# Altium schematic sheet input.SchDoc
size A; SheetNumber: 1; SheetTotal: 3
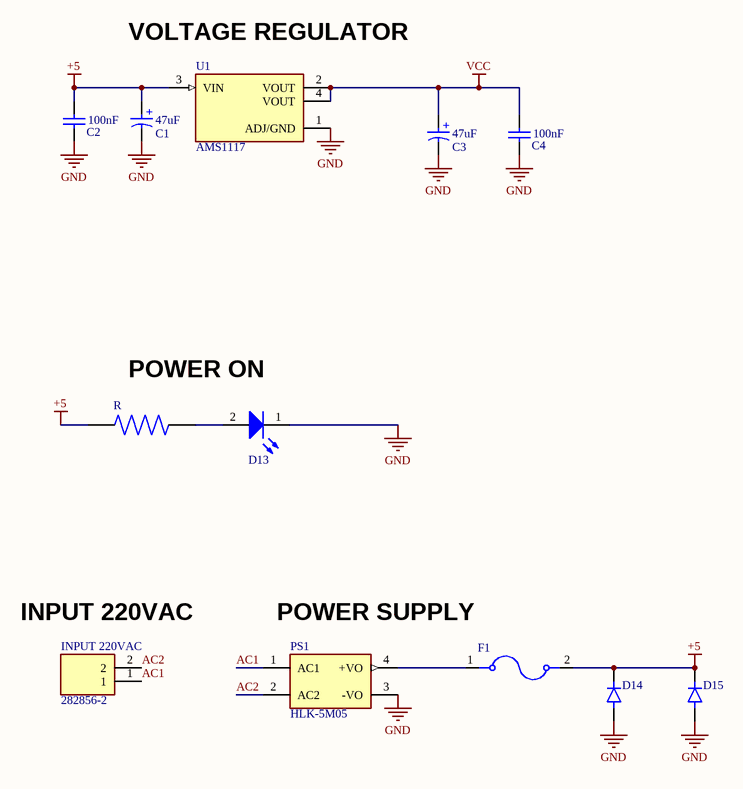
[diagram p0: input.SchDoc]

## Parts
C1  47uF  [WCAP-ASLI_D6.3H7.7]
C2  100nF  [WCAP-CSGP_0603_L1.6W0.8H0.8_Wave]
C3  47uF  [WCAP-ASLI_D6.3H7.7]
C4  100nF  [WCAP-CSGP_0603_L1.6W0.8H0.8_Wave]
D13  Infrared, 1.4V, 140°  [WL-SICW_0805_L2W1.3H0.8]  (value not drawn)
D14  S1G  [DIO_S1G]  (value not drawn)
D15  S1G  [DIO_S1G]  (value not drawn)
F1  0154004.DR  [FUSE_0154004.DR]  (value not drawn)
INPUT_220VAC  282856-2  [TE_282856-2]
PS1  HLK-5M05  [CONV_HLK-5M05]
R  FCR1206J10R  [RESC3216X70N]  (value not drawn)
U1  AMS1117  [SOT229P700X180-4N]

## Nets
+5: C1.1(P) C2.2 D14.1(K) D15.1(K) F1.2 R.1 U1.3(VIN)
GND: C1.2(N) C2.1 C3.2(N) C4.1 D13.1(K) D14.2(A) D15.2(A) PS1.3(-VO) U1.1(ADJ/GND)
VCC: C3.1(P) C4.2 U1.2(VOUT) U1.4(VOUT)
AC1: INPUT_220VAC.1 PS1.1(AC1)
AC2: INPUT_220VAC.2 PS1.2(AC2)
NetD13_2: D13.2(A) R.2
NetF1_1: F1.1 PS1.4(+VO)

## Notes on the sheet
- (near U1) VOLTAGE REGULATOR
- POWER ON
- (near INPUT_220VAC) INPUT 220VAC
- (near PS1) POWER SUPPLY
- (in symbol 865080443007) +

## Library data of the parts
C1 C3 = 865080443007: WCAP-ASLI Aluminum Electrolytic Capacitor, V-Chip, D6.3 x H5.5mm, 47uF, 25V; Manufacturer: Wurth Elektronik; Capacitance Tolerance: +/-20%; Dissipation Factor: 14%; Endurance: 2000h; Leakage Current: 11.75uA; Ripple Current: 220mA; Technical Reference: ASED055470M025DVCTBB000; Manufacturer Part Number: 865080443007; Category: Aluminum Electrolytic Capacitors; Match Code: WCAP-ASLI; ComponentLink1Description: Website Link; ComponentLink1URL: https://www.we-online.com/redexpert/article/865080443007?ad; ComponentLink2Description: Datasheet Link; ComponentLink2URL: https://www.we-online.com/redexpert/spec/865080443007?ad; Mount: Surface Mount; Operating Temperature Max: 105°C; Operating Temperature Min: -55°C; Packaging: Tape and Reel; Height: 5.5mm; Diameter: 6.3mm; Capacitance: 47uF; Rated Voltage (DC): 25V
C2 C4 = 885012206071: WCAP-CSGP Multilayer Ceramic Chip Capacitor, General Purpose, size 0603, X7R, 100nF, 25VDC; Manufacturer: Wurth Elektronik; Case/Size Code: 0603; Capacitance Tolerance: +/-10%; Dissipation Factor: 3.5%; Insulation Resistance: 5GΩ; Rated Voltage (DC): 25V; Technical Reference: X7R0603104K025DFCT10000; Manufacturer Part Number: 885012206071; Category: Multilayer Ceramic Chip Capacitors; Match Code: WCAP-CSGP; ComponentLink1Description: Website Link; ComponentLink1URL: https://www.we-online.com/redexpert/article/885012206071?ad; ComponentLink2Description: Datasheet Link; ComponentLink2URL: https://www.we-online.com/redexpert/spec/885012206071?ad; Mount: Surface Mount; Operating Temperature Max: 125°C; Operating Temperature Min: -55°C; Packaging: Tape and Reel; Length: 1.6mm; Width: 0.8mm; Height: 0.8mm; Capacitance: 100nF; Ceramic Type: X7R
D13 = 15412085BA400: WL-SICW SMT Chip LED Infrared Waterclear, size 1206, Infrared, 1.4V, 140°; Manufacturer: Wurth Elektronik; Case/Size Code: 1206; Centroid Wavelength: 850nm; Chip Technology: AlGaAs; Forward Voltage Max: 2V; Radiant Intensity: 2.5mW/sr; Radiant Intensity Min: 1mW/sr; Manufacturer Part Number: 15412085BA400; Category: Infrared LEDs; Match Code: WL-SICW; ComponentLink1Description: Website Link; ComponentLink1URL: https://www.we-online.com/redexpert/article/15412085BA400?ad; ComponentLink2Description: Datasheet Link; ComponentLink2URL: https://www.we-online.com/redexpert/spec/15412085BA400?ad; Mount: Surface Mount; Operating Temperature Max: 85°C; Operating Temperature Min: -40°C; Packaging: Tape and Reel; Length: 3.2mm; Width: 1.6mm; Height: 1.1mm; Emitting Color: Infrared; Forward Voltage: 1.4V; Peak Wavelength: 850nm; Viewing Angle: 140°
D14 D15 = S1G: Diode Standard 400 V 1A Surface Mount DO-214AC (SMA); MF: ON Semiconductor; SnapEDA_Link: https://www.snapeda.com/parts/S1G/Onsemi/view-part/?ref=snap; Value: *; MP: S1G; Availability: In Stock; Purchase-URL: https://pricing.snapeda.com/search/part/S1G/?ref=eda; Check_prices: https://www.snapeda.com/parts/S1G/Onsemi/view-part/?ref=eda; Package: SMA Taiwan Semiconductor; Price: None
F1 = 0154004.DR: 154/154T/154L/154TL Series OMNI-BLOKÂ® Fuse and Holder Assembly; Package: None; Availability: Unavailable; Value: *; MP: 0154004.DR; Price: None
INPUT_220VAC = 282856-2: TERMI-BLOK PCB MOUNT 2P; MF: TE Connectivity; Purchase-URL: https://pricing.snapeda.com/search/part/282856-2/?ref=eda; Package: None; MP: 282856-2; EU_RoHS_Compliance: Compliant with Exemptions; Price: None; Availability: In Stock; Value: *; Check_prices: https://www.snapeda.com/parts/282856-2/TE+Connectivity+AMP+Connectors/view-part/?ref=eda; SnapEDA_Link: https://www.snapeda.com/parts/282856-2/TE+Connectivity+AMP+Connectors/view-part/?ref=snap
PS1 = HLK-5M05: AC DC 220V to 5V 5W 5Watt Isolated Switching Step-Down Power Supply Module Converter; MF: Hi-link; Check_prices: https://www.snapeda.com/parts/HLK-5M05/Hi-link/view-part/?ref=eda; SnapEDA_Link: https://www.snapeda.com/parts/HLK-5M05/Hi-link/view-part/?ref=snap; Price: None; Availability: Not in stock; Package: Package; MP: HLK-5M05; Value: *
R = FCR1206J10R: Res 1206 10 Ohm 5% 1/8W Â±500ppm/Â°C Molded SMD SMD T/R; Resistance: 10; Power_Rating: .125 W; MF: TE Connectivity; DigiKey-Purchase-URL: https://snapeda.com/shop?store=DigiKey&id=988597; Package: 1206; EU_RoHS_Compliance: Compliant with Exemptions; Tolerance: 5%; Value: *; MP: FCR1206J10R; Price: None; SnapEDA_Link: https://www.snapeda.com/parts/FCR1206J10R/TE%20Connectivity%20Passive%20Product/view-part/988597/?ref=snap; Mouser-Purchase-URL: https://snapeda.com/shop?store=Mouser&id=988597; Availability: Warning
U1 = AMS1117: 1A LOW DROPOUT VOLTAGE REGULATOR SOT-223; MF: Advanced Monolithic Systems; Price: None; Availability: Not in stock; Package: SOT-223 Seeed Technology; MP: AMS1117; Value: *; SnapEDA_Link: https://www.snapeda.com/parts/AMS1117/Advanced+Monolithic+Systems/view-part/?ref=snap; Check_prices: https://www.snapeda.com/parts/AMS1117/Advanced+Monolithic+Systems/view-part/?ref=eda